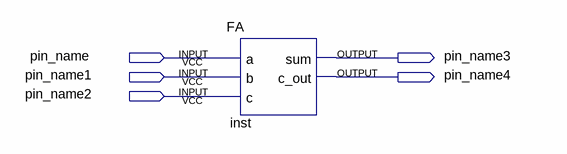
[diagram p0: schematic sheet]
// Quartus schematic full_adder.bdf as structural Verilog: 1 symbols, 5 pins
module full_adder (
  input  pin_name,
  input  pin_name1,
  input  pin_name2,
  output pin_name3,
  output pin_name4
);

  FA inst (.a(pin_name), .b(pin_name1), .c(pin_name2), .sum(pin_name3), .c_out(pin_name4));
endmodule
